# EasyEDA schematic d-sub15.json
TITLE: Sheet_1; REV: 1.0; Date: 2024-10-26; Sheet: 1/1; Company: Your Company
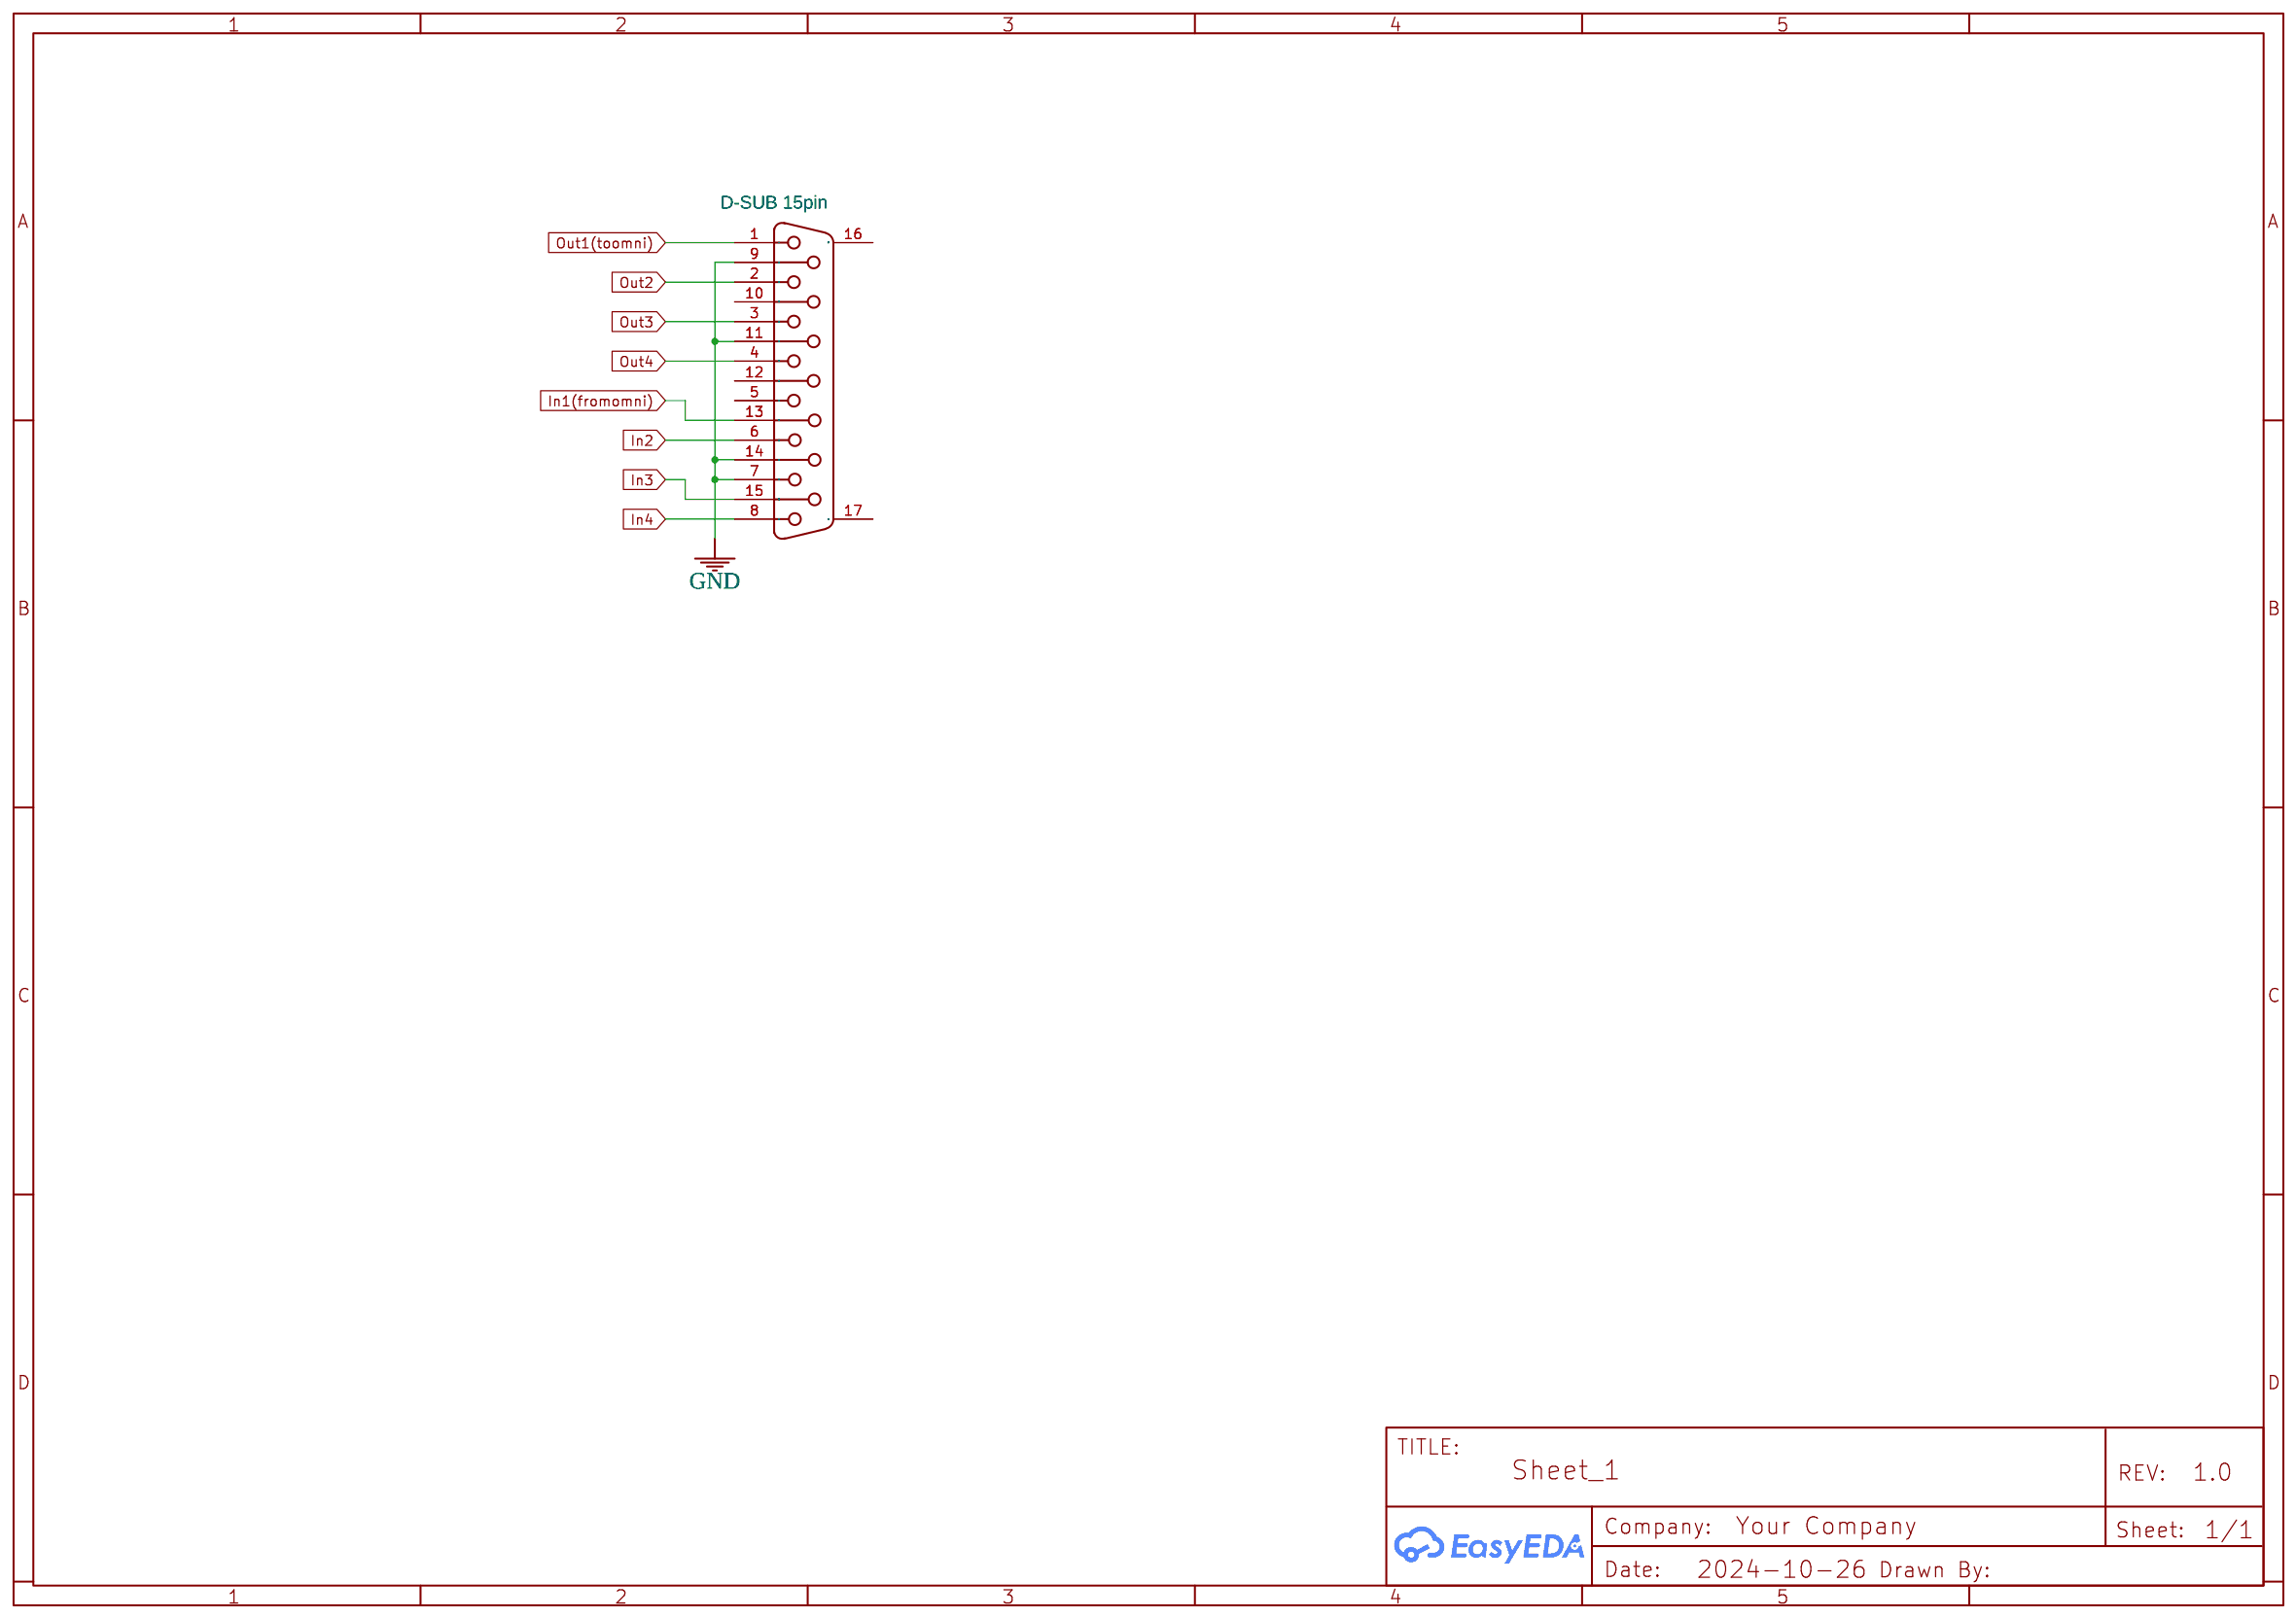
[diagram p0: schematic sheet]

## Parts
U1  D-SUB 15pin  [DB15-TH_X0215FC2W5]

## Library data of the parts
U1 = D-SUB-DP-15PYM-AW: Supplier: LCSC; Supplier Part: C19077343; Manufacturer: XUNPU(讯普); Contributor: lcsc

## Nets
GND: U1.7 U1.9 U1.11 U1.14
In1(fromomni): U1.13
In2: U1.6
In3: U1.15
In4: U1.8
Out1(toomni): U1.1
Out2: U1.2
Out3: U1.3
Out4: U1.4

Not connected (* = marked no-connect by the designer): U1 5 10 12 16(MH2) 17(MH1)
